# EAGLE design 32a4u_1.0.1 (EAGLE 5.11)
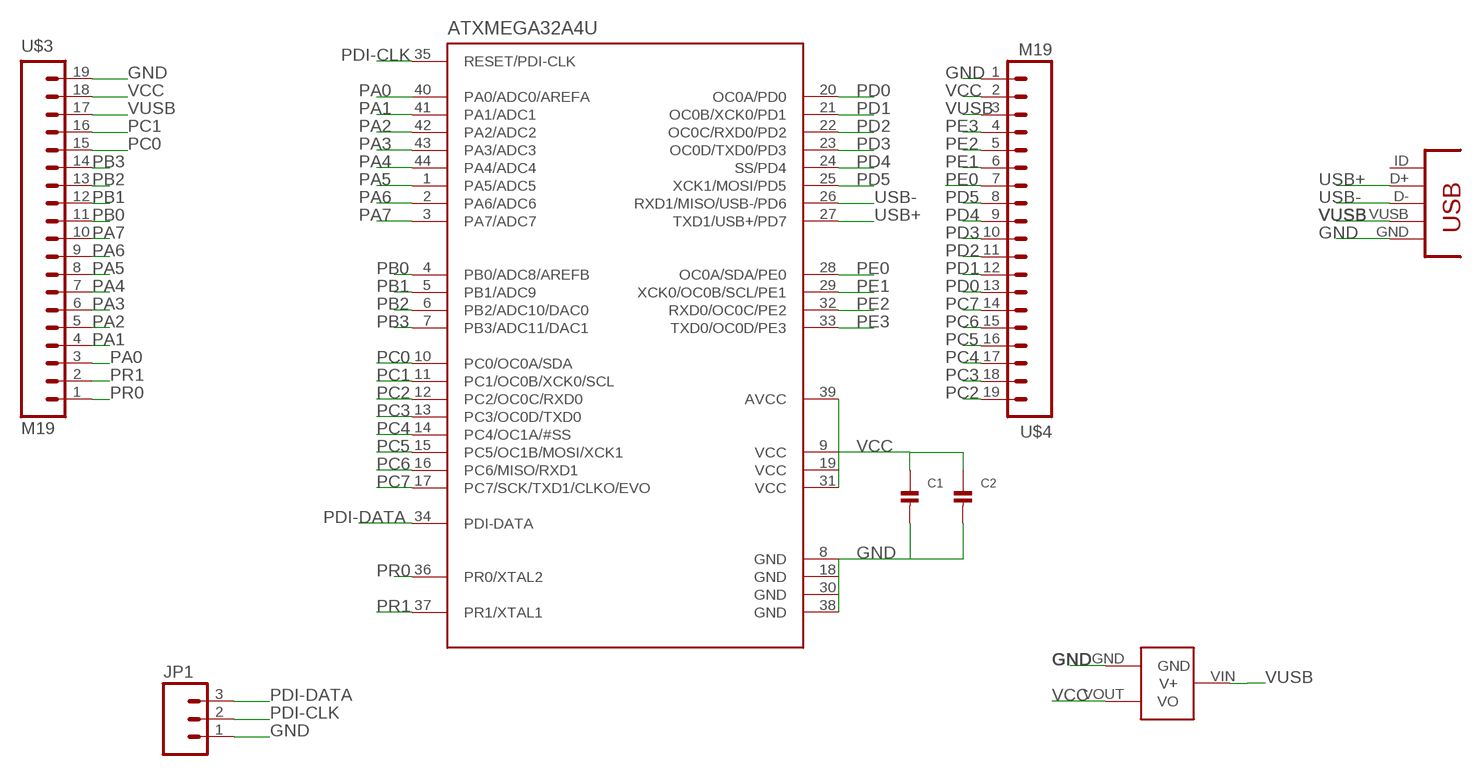
[diagram p0: schematic, sheet 1]

## Parts
ATXMEGA32A4U  ATXMEGAXXA4U  [TQFP-44]
C1  CAP_CERAMIC0603  [0603]
C2  CAP_CERAMIC0603  [0603]
JP1  M03LOCK  [1X03_LOCK]
U$2  MCP1700  [SOT23-3]
U$3  M19  [1X19]
U$4  M19  [1X19]
USB1  USB-MINI-BUSB1  [CONN_USB_MINI-B]

## Nets
GND: ATXMEGA32A4U.8(GND) ATXMEGA32A4U.18(GND) ATXMEGA32A4U.30(GND) ATXMEGA32A4U.38(GND) C1.2 C2.2 JP1.1 U$2.GND U$3.19 U$4.1 USB1.GND
PA0: ATXMEGA32A4U.40(PA0/ADC0/AREFA) U$3.3
PA1: ATXMEGA32A4U.41(PA1/ADC1) U$3.4
PA2: ATXMEGA32A4U.42(PA2/ADC2) U$3.5
PA3: ATXMEGA32A4U.43(PA3/ADC3) U$3.6
PA4: ATXMEGA32A4U.44(PA4/ADC4) U$3.7
PA5: ATXMEGA32A4U.1(PA5/ADC5) U$3.8
PA6: ATXMEGA32A4U.2(PA6/ADC6) U$3.9
PA7: ATXMEGA32A4U.3(PA7/ADC7) U$3.10
PB0: ATXMEGA32A4U.4(PB0/ADC8/AREFB) U$3.11
PB1: ATXMEGA32A4U.5(PB1/ADC9) U$3.12
PB2: ATXMEGA32A4U.6(PB2/ADC10/DAC0) U$3.13
PB3: ATXMEGA32A4U.7(PB3/ADC11/DAC1) U$3.14
PC0: ATXMEGA32A4U.10(PC0/OC0A/SDA) U$3.15
PC1: ATXMEGA32A4U.11(PC1/OC0B/XCK0/SCL) U$3.16
PC2: ATXMEGA32A4U.12(PC2/OC0C/RXD0) U$4.19
PC3: ATXMEGA32A4U.13(PC3/OC0D/TXD0) U$4.18
PC4: ATXMEGA32A4U.14(PC4/OC1A/#SS) U$4.17
PC5: ATXMEGA32A4U.15(PC5/OC1B/MOSI/XCK1) U$4.16
PC6: ATXMEGA32A4U.16(PC6/MISO/RXD1) U$4.15
PC7: ATXMEGA32A4U.17(PC7/SCK/TXD1/CLKO/EVO) U$4.14
PD0: ATXMEGA32A4U.20(OC0A/PD0) U$4.13
PD1: ATXMEGA32A4U.21(OC0B/XCK0/PD1) U$4.12
PD2: ATXMEGA32A4U.22(OC0C/RXD0/PD2) U$4.11
PD3: ATXMEGA32A4U.23(OC0D/TXD0/PD3) U$4.10
PD4: ATXMEGA32A4U.24(SS/PD4) U$4.9
PD5: ATXMEGA32A4U.25(XCK1/MOSI/PD5) U$4.8
PDI-CLK: ATXMEGA32A4U.35(RESET/PDI-CLK) JP1.2
PDI-DATA: ATXMEGA32A4U.34(PDI-DATA) JP1.3
PE0: ATXMEGA32A4U.28(OC0A/SDA/PE0) U$4.7
PE1: ATXMEGA32A4U.29(XCK0/OC0B/SCL/PE1) U$4.6
PE2: ATXMEGA32A4U.32(RXD0/OC0C/PE2) U$4.5
PE3: ATXMEGA32A4U.33(TXD0/OC0D/PE3) U$4.4
PR0: ATXMEGA32A4U.36(PR0/XTAL2) U$3.1
PR1: ATXMEGA32A4U.37(PR1/XTAL1) U$3.2
USB+: ATXMEGA32A4U.27(TXD1/USB+/PD7) USB1.D+
USB-: ATXMEGA32A4U.26(RXD1/MISO/USB-/PD6) USB1.D-
VCC: ATXMEGA32A4U.9(VCC) ATXMEGA32A4U.19(VCC) ATXMEGA32A4U.31(VCC) ATXMEGA32A4U.39(AVCC) C1.1 C2.1 U$2.VOUT(VO) U$3.18 U$4.2
VUSB: U$2.VIN(V+) U$3.17 U$4.3 USB1.VUSB
Unconnected: USB1.BODY@1(BODY) USB1.BODY@2(BODY) USB1.BODY@3(BODY) USB1.BODY@4(BODY) USB1.ID(USBID)

## Library data of the parts
ATXMEGA32A4U = nonolith:ATXMEGAXXA4U: ATXMEGA A4U Series (XMEGA+USB)
C1 C2 = nonolith:CAP_CERAMIC: Ceramic Capacitors 0402 - 0402 Surface Mount Capacitors 0.1uF 10V 10% [Digikey: 490-1318-2-ND] 0603 - 0603 Surface Mount Capacitors 16 pF 50V 5% [Digikey: 445-5051-2-ND] 22 pF 50V [Digikey: PCC220ACVTR-ND] 33 pF 50V 5% [Digikey: 490-1415-1-ND] 56pF 50V 5% [Digikey: 490-1421-1-ND] 220pF 50V 5% [Digikey: 445-1285-1-ND] 680 pF 50V 2200 pF 50V 5% C0G [Digikey: 445-1297-1-ND] 5600 pF 100V 5% X7R [Digikey: 478-3711-1-ND] 0.1 µF 25V 10% [Digikey: PCC2277TR-ND] 0.22 µF 16V 10% X7R [Digikey: 445-1318-1-ND] 1.0 µF 25V 10% [Digikey: 445-5146-2-ND] 0603 - RF Specific 3pF 250V +/-0.1pF RF [Digikey: 712-1347-1-ND] 18 pF 250V 5% [Digikey: 478-3505-1-ND or 712-1322-1-ND] 56 pF 250V 5% C0G RF [Digikey: 490-4867-1-ND] 68 pF 250V RF [Digikey: 490-4868-1-ND] 0805 - 0805 Surface Mount Capacitors 220 pF 250V 2% RF Ceramic Capacitor [Digikey: 712-1398-1-ND] 1000 pF 50V 2% NP0 Ceramic Capacitor [Digikey: 478-3760-1-ND] 0.1 µF 25V 10% Ceramic Capacitor [Digikey: PCC1828TR-ND] 1.0 µF 16V 10% Ceramic Capacitor[Digikey: 490-1691-2-ND] 10.0 µF 10V 10% Ceramic Capacitor[Digikey: 709-1228-1-ND] 1206 - 1206 Surface Mount Capacitors
JP1 = SparkFun:M03: Header 3 Standard 3-pin 0.1" header. Use with straight break away headers (SKU : PRT-00116), right angle break away headers (PRT-00553), swiss pins (PRT-00743), machine pins (PRT-00117), and female headers (PRT-00115). Molex polarized connector foot print use with SKU : PRT-08232 with associated crimp pins and housings.
U$2 = nonolith:MCP1700: Voltage regulator
U$3 U$4 = SparkFun:M19
USB1 = nonolith:USB-MINI-B: USB connector

## Net classes
0 default: width 0.203 mm, clearance 0.203 mm

## Board
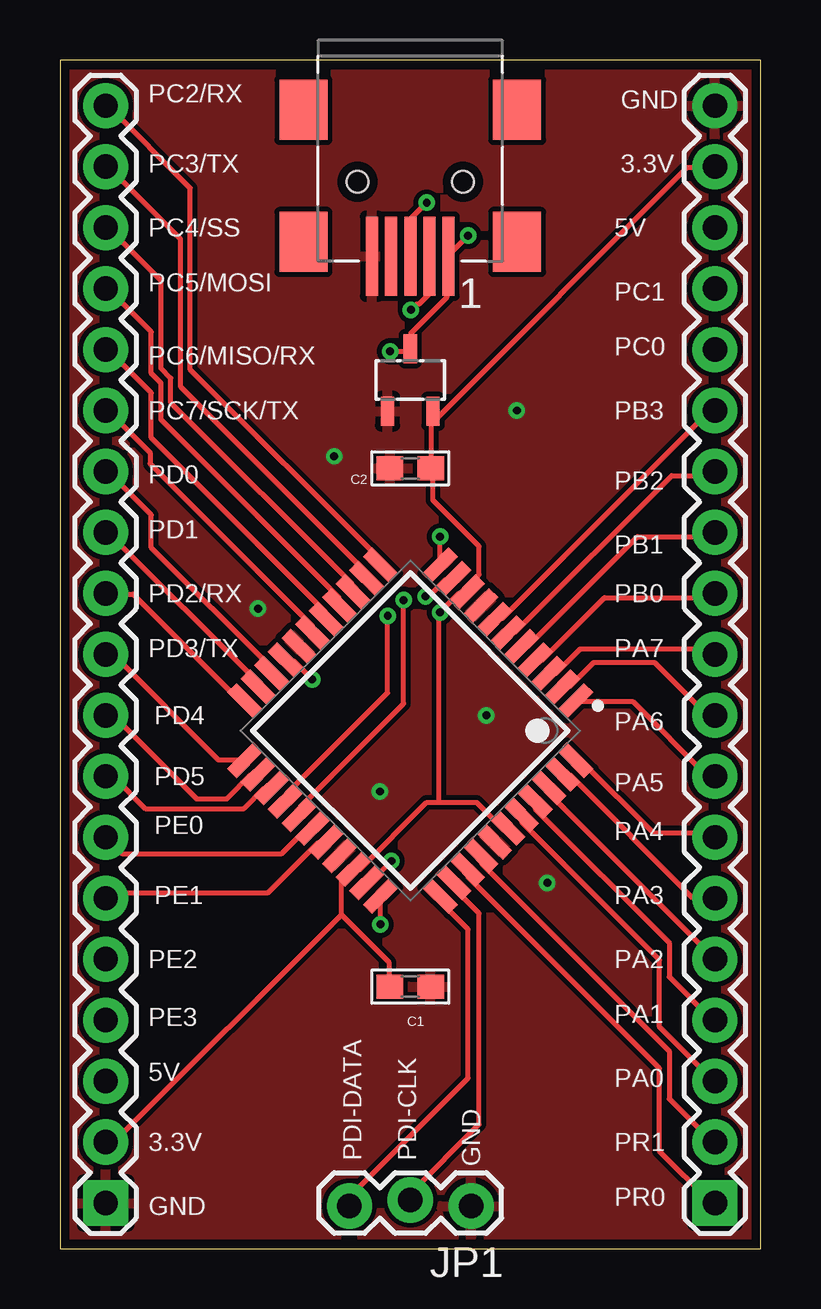
[diagram p1: board, top side]
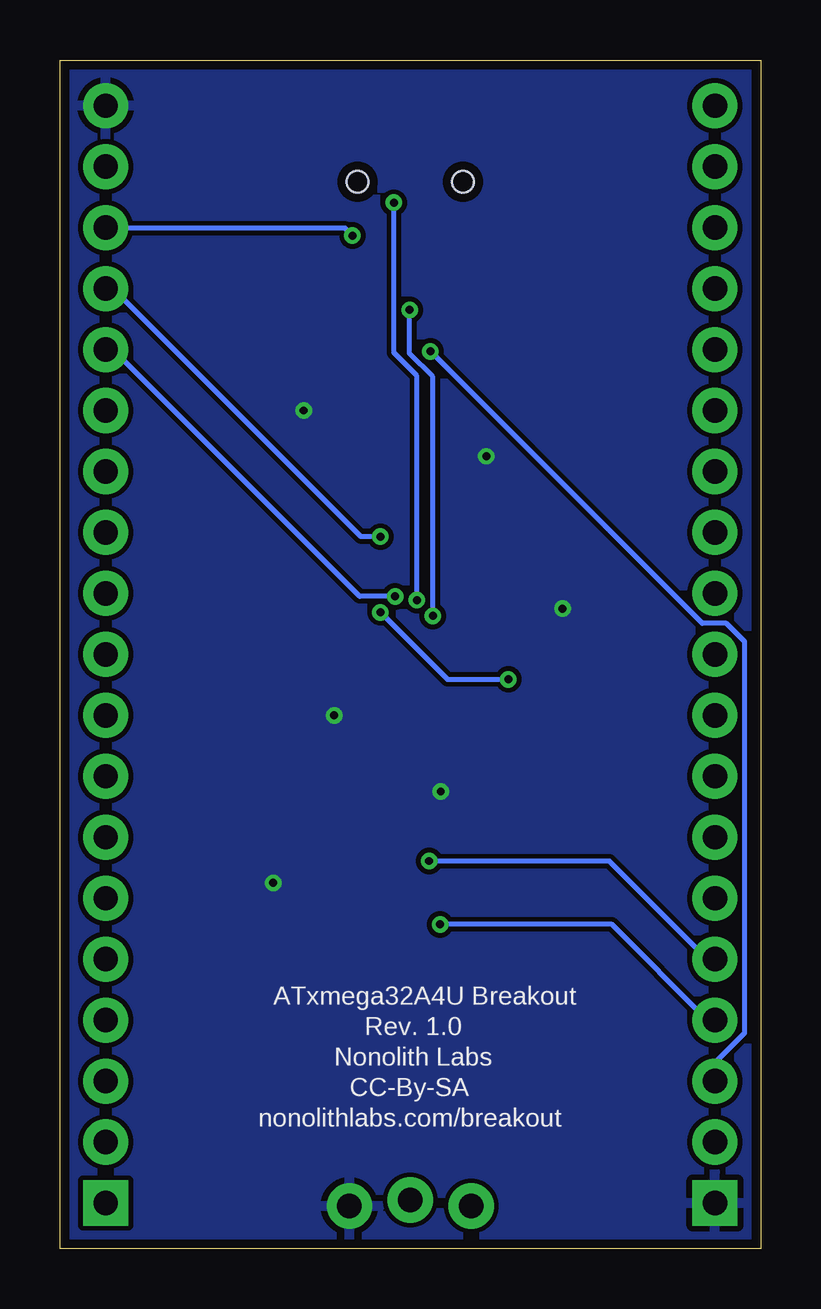
[diagram p2: board, bottom side, seen from below]

Size 29.21 x 49.53 mm. Coordinates in mm from the lower left corner, seen from the top.
Outline: 0,0 29.21,0 29.21,49.53 0,49.53 0,0
Copper layers (1*16): Top 0.0356mm / dielectric 1.5011mm / Bottom 0.0356mm
Design rules "LaenPCBOrder": minimum track width 6mil, minimum drill 13mil, track to track 6mil, track to pad 6mil, pad to pad 6mil, via to via 6mil, smd to smd 6mil, copper to edge 15mil, drill to drill 6mil, minimum pad ring 7mil, minimum via ring 7mil, stop-mask expansion 4mil, vias tented up to drill 0mil, thermal gap 10mil

### Footprints (pad centres in the part's own frame; a part is rotated, then mirrored left to right if it is on the bottom)
TQFP-44 = smd 1.55 x 0.55: 1 -5.75,4; 2 -5.75,3.2; 3 -5.75,2.4; 4 -5.75,1.6; 5 -5.75,0.8; 6 -5.75,0; 7 -5.75,-0.8; 8 -5.75,-1.6; 9 -5.75,-2.4; 10 -5.75,-3.2; 11 -5.75,-4; 23 5.75,-4; 24 5.75,-3.2; 25 5.75,-2.4; 26 5.75,-1.6; 27 5.75,-0.8; 28 5.75,0; 29 5.75,0.8; 30 5.75,1.6; 31 5.75,2.4; 32 5.75,3.2; 33 5.75,4 | smd 0.55 x 1.55: 12 -4,-5.75; 13 -3.2,-5.75; 14 -2.4,-5.75; 15 -1.6,-5.75; 16 -0.8,-5.75; 17 0,-5.75; 18 0.8,-5.75; 19 1.6,-5.75; 20 2.4,-5.75; 21 3.2,-5.75; 22 4,-5.75; 34 4,5.75; 35 3.2,5.75; 36 2.4,5.75; 37 1.6,5.75; 38 0.8,5.75; 39 0,5.75; 40 -0.8,5.75; 41 -1.6,5.75; 42 -2.4,5.75; 43 -3.2,5.75; 44 -4,5.75
0603 = smd 1.1 x 1: 1 -0.85,0; 2 0.85,0
1X03_LOCK = drill 1.016 pad 1.88 round: 1 0,0.127; 2 2.54,-0.127; 3 5.08,0.127
SOT23-3 = smd 0.55 x 1.2: GND 0.95,1.3; VIN 0,-1.3; VOUT -0.95,1.3
1X19 = drill 1.016 pad 1.88 square: 1 0,0 | drill 1.016 pad 1.88 round: 2 2.54,0; 3 5.08,0; 4 7.62,0; 5 10.16,0; 6 12.7,0; 7 15.24,0; 8 17.78,0; 9 20.32,0; 10 22.86,0; 11 25.4,0; 12 27.94,0; 13 30.48,0; 14 33.02,0; 15 35.56,0; 16 38.1,0; 17 40.64,0; 18 43.18,0; 19 45.72,0
CONN_USB_MINI-B = smd 2 x 2.5: BODY@1 -4.45,2.5; BODY@2 4.45,2.5; BODY@3 4.45,-3; BODY@4 -4.45,-3 | smd 0.5 x 3.3: D+ 0,3.1; D- -0.8,3.1; GND 1.6,3.1; ID 0.8,3.1; VUSB -1.6,3.1 | hole 0.9: -2.2,0; 2.2,0

### Placement (x,y rotation side)
ATXMEGA32A4U  14.61,21.59 225 top
C1  14.61,10.92 0 top
C2  14.61,32.51 180 top
JP1  17.14,1.9 180 top
U$2  14.61,36.2 180 top
U$3  27.3,1.9 90 top
U$4  1.91,1.9 90 top
USB1  14.61,44.45 180 top

### Tracks (layer width: path | path; a pad name or v marks a point on that pad's centre or on a via)
GND  (via drill 0.33)
  other vias: 13.34,19.05 8.25,26.67 17.78,22.23 20.32,15.24 19.05,34.92 11.43,33.02
  pour Bottom: -3.05,51.56 -3.05,-1.4 34.29,-1.4 34.29,52.2
  pour Top: 35.94,53.47 -4.95,53.47 -4.95,-0.64 35.05,-1.91 35.05,-1.52 35.31,7.37
PA0
  Top 0.203: ATXMEGA32A4U.40 19.25,18.09 19.25,17.78 24.99,12.04 24.99,9.25 27.28,6.96 U$3.3
PA1
  Top 0.203: ATXMEGA32A4U.41 19.81,18.64 19.81,18.34 25.4,12.75 25.4,11.33 27.18,9.55 27.28,9.55 U$3.4
PA2
  Top 0.203: ATXMEGA32A4U.42 20.37,19.2 20.37,19 U$3.5
PA3
  Top 0.203: ATXMEGA32A4U.43 20.98,19.76 21.23,19.76 26.37,14.63 27.28,14.63 U$3.6
PA4
  Top 0.203: ATXMEGA32A4U.44 21.54,20.32 21.74,20.32 24.74,17.32 27.13,17.32 U$3.7
PA5
  Top 0.203: ATXMEGA32A4U.1 21.54,22.81 23.88,22.81 26.98,19.71 27.28,19.71 U$3.8
PA6
  Top 0.203: ATXMEGA32A4U.2 20.98,23.42 21.23,23.42 22.25,24.43 24.79,24.43 26.98,22.25 27.28,22.25 U$3.9
PA7
  Top 0.203: ATXMEGA32A4U.3 20.37,23.98 20.68,23.98 21.69,24.99 27.08,24.99 U$3.10
PB0
  Top 0.203: ATXMEGA32A4U.4 19.81,24.54 20.12,24.54 22.71,27.13 27.13,27.13 U$3.11
PB1
  Top 0.203: ATXMEGA32A4U.5 19.25,25.09 19.51,25.09 24.08,29.67 27.13,29.67 U$3.12
PB2
  Top 0.203: ATXMEGA32A4U.6 18.69,25.71 19,25.71 25.5,32.21 27.13,32.21 U$3.13
PB3
  Top 0.203: ATXMEGA32A4U.7 18.14,26.26 18.44,26.26 27.08,34.9 27.28,34.9 U$3.14
PC0  (via drill 0.33)
  Top 0.203: v15.24,27.18 15.39,27.18 16.1,27.89 16.36,27.89 ATXMEGA32A4U.10
  Bottom 0.203: v15.24,27.18 16.71,27.18 26.98,37.44 27.28,37.44 U$3.15
PC1  (via drill 0.33)
  Top 0.203: v15.85,29.67 15.85,28.5 ATXMEGA32A4U.11
  Bottom 0.203: v15.85,29.67 16.66,29.67 26.98,39.98 27.28,39.98 U$3.16
PC2
  Top 0.203: ATXMEGA32A4U.12 13.36,28.5 13.36,28.7 5.44,36.63 5.44,44.2 2.03,47.6 1.93,47.6 U$4.19
PC3
  Top 0.203: ATXMEGA32A4U.13 12.8,27.94 12.8,28.14 5.03,35.92 5.03,42.06 2.03,45.06 1.93,45.06 U$4.18
PC4
  Top 0.203: ATXMEGA32A4U.14 12.19,27.38 12.19,27.69 4.62,35.25 4.62,36.27 4.22,36.68 4.22,40.33 2.03,42.52 1.93,42.52 U$4.17
PC5
  Top 0.203: ATXMEGA32A4U.15 11.63,26.82 11.63,27.13 4.22,34.54 4.22,36.07 3.81,36.47 3.81,38.2 2.03,39.98 1.93,39.98 U$4.16
PC6
  Top 0.203: ATXMEGA32A4U.16 11.07,26.26 11.07,26.52 3.81,33.78 3.81,35.66 2.03,37.44 1.93,37.44 U$4.15
PC7
  Top 0.203: ATXMEGA32A4U.17 10.52,25.71 10.52,25.96 3.76,32.71 3.76,33.17 2.03,34.9 1.93,34.9 U$4.14
PD0
  Top 0.203: ATXMEGA32A4U.20 8.84,23.98 8.84,24.18 3.81,29.21 3.81,30.58 2.03,32.36 1.93,32.36 U$4.13
PD1
  Top 0.203: ATXMEGA32A4U.21 8.23,23.42 8.23,23.62 2.03,29.82 1.93,29.82 U$4.12
PD2
  Top 0.203: ATXMEGA32A4U.22 7.67,22.86 7.47,22.86 3.05,27.28 1.93,27.28 U$4.11
PD3
  Top 0.203: ATXMEGA32A4U.23 7.67,20.37 6.6,20.37 2.24,24.74 1.93,24.74 U$4.10
PD4
  Top 0.203: ATXMEGA32A4U.24 8.23,19.76 7.98,19.76 6.96,18.75 5.69,18.75 2.24,22.2 1.93,22.2 U$4.9
PD5
  Top 0.203: ATXMEGA32A4U.25 8.84,19.2 8.53,19.2 7.67,18.34 3.56,18.34 2.24,19.66 1.93,19.66 U$4.8
PDI-CLK
  Top 0.203: ATXMEGA32A4U.35 16.41,15.24 16.41,15.04 17.48,13.97 17.48,5.18 14.63,2.34 14.63,2.03 JP1.2
PDI-DATA
  Top 0.203: ATXMEGA32A4U.34 15.85,14.68 15.85,14.48 17.02,13.31 17.02,7.11 12.09,2.18 12.09,1.78 JP1.3
PE0
  Top 0.203: ATXMEGA32A4U.28 10.52,17.48 10.26,17.48 9.25,16.46 2.59,16.46 U$4.7
PE1
  Top 0.203: ATXMEGA32A4U.29 11.07,16.92 10.77,16.92 8.69,14.83 2.13,14.83 U$4.6
PE2  (via drill 0.33)
  Top 0.203: v13.82,16.15 12.95,15.29 12.85,15.29 ATXMEGA32A4U.32
  Bottom 0.203: v13.82,16.15 6.3,16.15 2.24,12.09 1.93,12.09 U$4.5
PE3  (via drill 0.33)
  Top 0.203: v13.36,13.51 13.36,14.68 ATXMEGA32A4U.33
  Bottom 0.203: v13.36,13.51 6.2,13.51 2.24,9.55 1.93,9.55 U$4.4
PR0
  Top 0.203: ATXMEGA32A4U.36 17.02,15.8 17.02,15.49 24.99,7.52 24.99,4.06 27.13,1.93 27.28,1.93 U$3.1
PR1
  Top 0.203: ATXMEGA32A4U.37 17.58,16.36 17.58,16.05 25.4,8.23 25.4,6.25 27.18,4.47 27.28,4.47 U$3.2
USB+  (via drill 0.33)
  Top 0.203: v14.33,27.03 14.33,22.71 10.01,18.39 10.01,18.14 ATXMEGA32A4U.27 | v15.29,43.59 14.63,42.93 14.63,41.35 USB1.D+
  Bottom 0.203: v14.33,27.03 14.33,36.37 15.29,37.34 v15.29,43.59
USB-  (via drill 0.33)
  Top 0.203: v13.66,26.37 13.66,23.16 9.45,18.95 9.45,18.69 ATXMEGA32A4U.26 | v14.63,39.12 14.88,39.37 14.99,39.37 15.39,39.78 15.39,41.3 USB1.D-
  Bottom 0.203: v13.66,26.37 13.66,36.32 14.63,37.29 v14.63,39.12
VCC  (via drill 0.33)
  Top 0.203: 11.73,13.92 13.72,11.94 13.72,10.92 C1.1 | 11.73,13.92 11.73,15.29 12.24,15.8 ATXMEGA32A4U.31 12.34,15.8 12.5,15.8 15.29,18.59 15.8,18.59 | 15.8,18.59 17.37,18.59 18.44,17.53 18.64,17.53 ATXMEGA32A4U.39 | U$4.2 1.93,4.47 2.29,4.47 11.73,13.92 | v10.52,23.72 9.75,24.49 9.45,24.49 ATXMEGA32A4U.19 | U$3.18 27.28,45.06 26.16,45.06 15.55,34.44 U$2.VOUT 15.55,34.85 15.49,34.8 15.49,32.51 C2.1 15.55,32.46 15.55,31.19 17.48,29.26 17.48,28.09 16.76,27.38 ATXMEGA32A4U.9 16.97,27.33 16.66,27.33 v15.85,26.52 15.8,26.47 15.8,18.59
  Bottom 0.203: v10.52,23.72 13.06,23.72 v15.85,26.52
VUSB  (via drill 0.33)
  Top 0.203: v13.77,37.39 14.48,37.39 14.53,37.44 U$2.VIN 14.63,37.54 14.63,38.15 16.15,39.67 16.15,41.3 USB1.VUSB 16.21,41.4 v17.02,42.21
  Bottom 0.203: v13.77,37.39 2.44,26.06 1.42,26.06 0.66,25.3 0.66,8.99 1.88,7.77 1.88,7.01 U$4.3 | v17.02,42.21 17.32,42.52 27.28,42.52 U$3.17

### Text on the board
tNames: PC2/RX | GND | PC3/TX | 3.3V | PC4/SS | 5V | PC5/MOSI | PC1 | PC6/MISO/RX | PC0 | PC7/SCK/TX | PB3 | PD0 | PB2 | PD1 | PB1 | PD2/RX | PB0 | PD3/TX | PA7 | PD4 | PA6 | PD5 | PA5 | PE0 | PA4 | PE1 | PA3 | PE2 | PA2 | PE3 | PA1 | 5V | PA0 | 3.3V | PDI-DATA | PDI-CLK | GND | PR1 | GND | PR0
bNames: ATxmega32A4U Breakout | Rev. 1.0 | Nonolith Labs | CC-By-SA | nonolithlabs.com/breakout